# EAGLE design iMote (EAGLE 6.4)
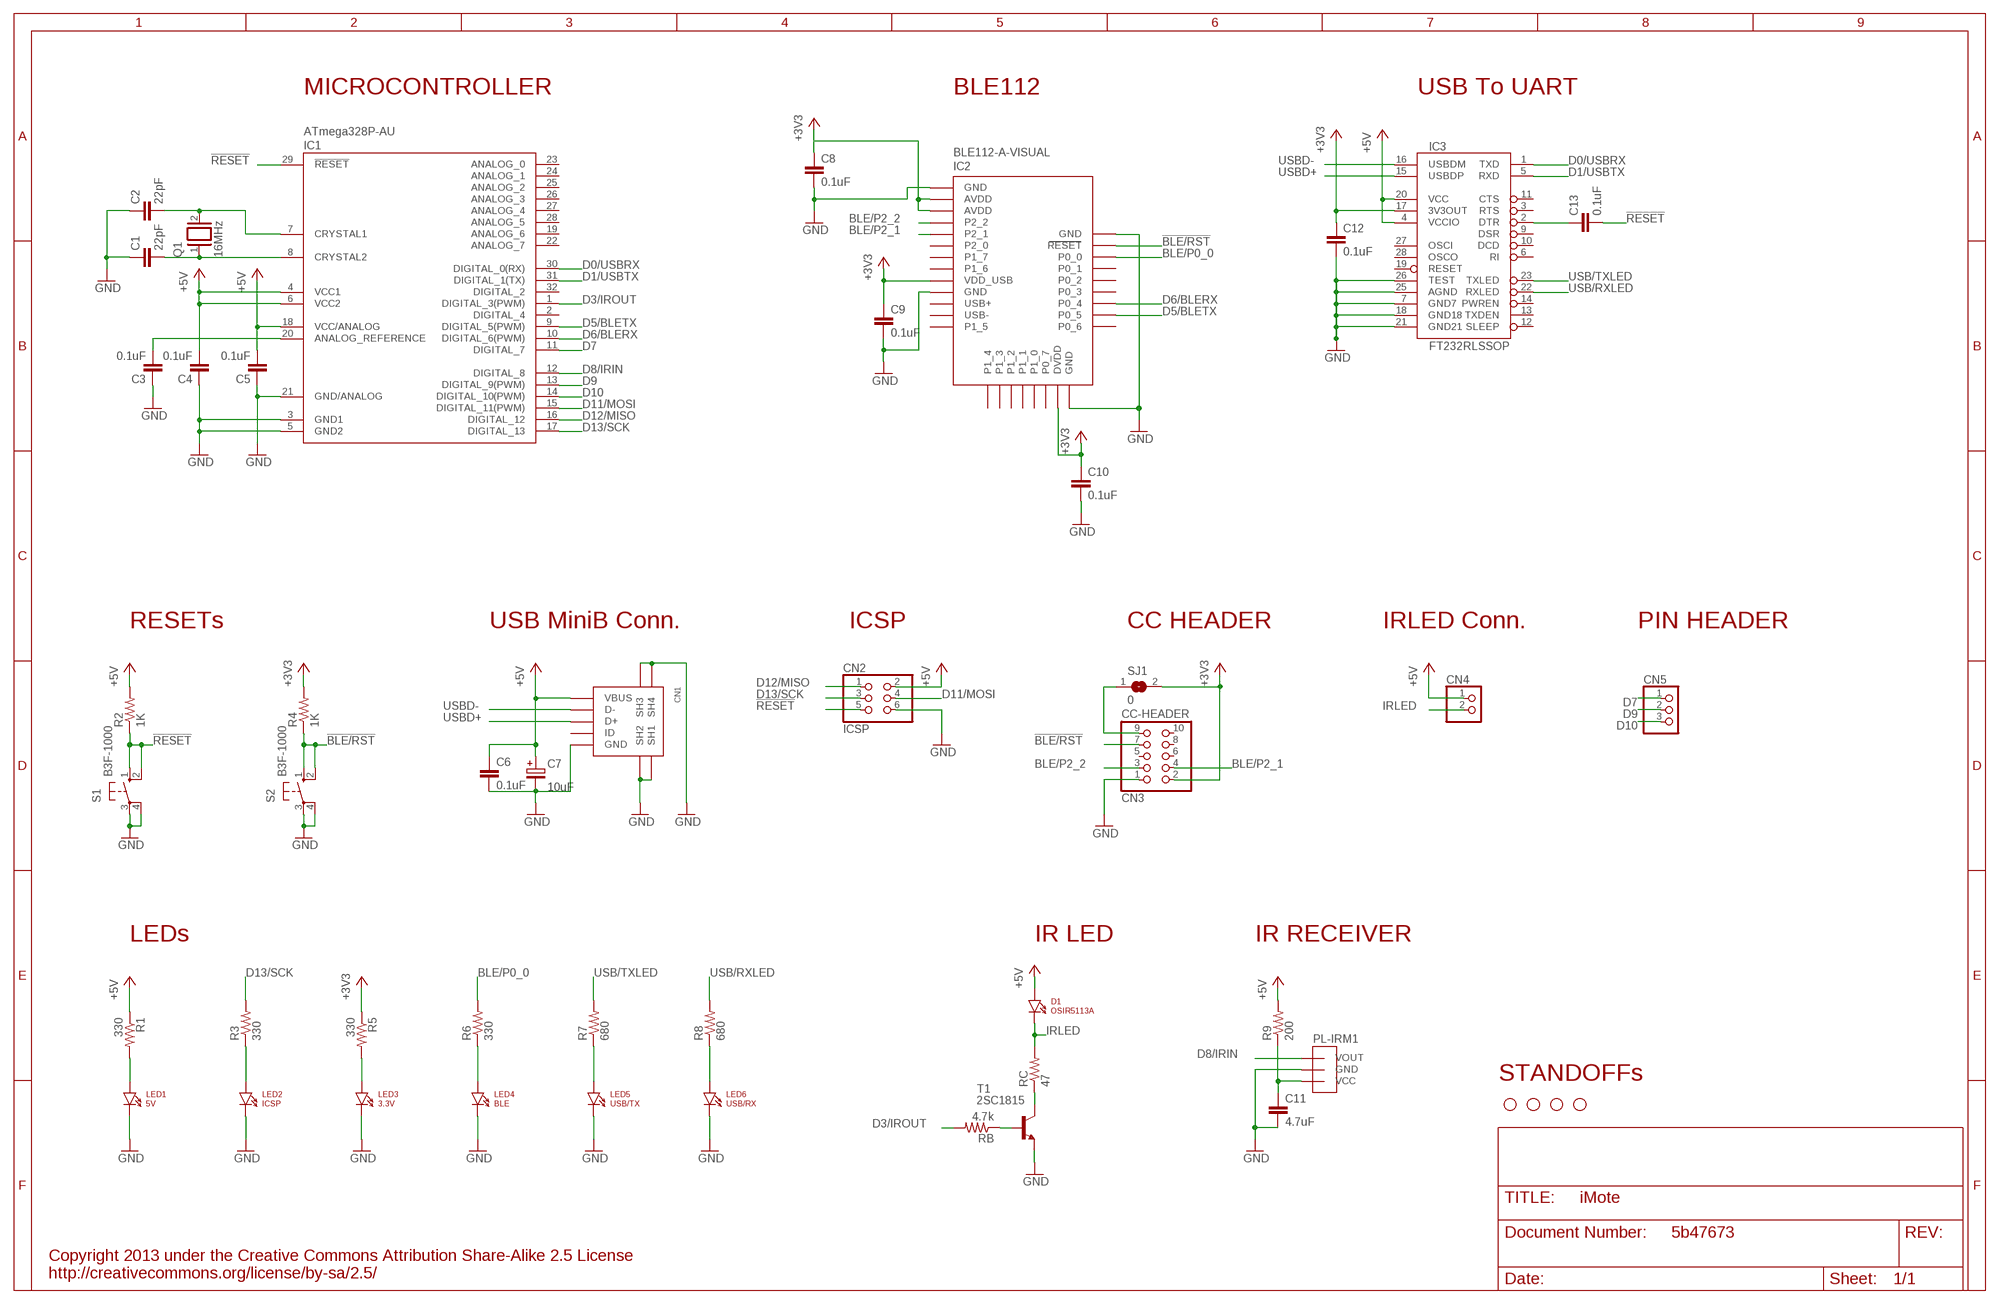
[diagram p0: schematic, sheet 1]

## Parts
C1  22pF  C-2012  [2012]
C2  22pF  C-2012  [2012]
C3  0.1uF  C-2012  [2012]
C4  0.1uF  C-2012  [2012]
C5  0.1uF  C-2012  [2012]
C6  0.1uF  C-2012  [2012]
C7  10uF  CPOL  [E2-5]
C8  0.1uF  C-2012  [2012]
C9  0.1uF  C-2012  [2012]
C10  0.1uF  C-2012  [2012]
C11  4.7uF  C-2012  [2012]
C12  0.1uF  C-2012  [2012]
C13  0.1uF  C-2012  [2012]
CN1  USB-MINIB-UX60SC-MB  [USB-MINIB-UX60SC-MB]
CN2  ICSP  PINHD-2X3  [2X03]
CN3  CC-HEADER  PINHD-2X5  [2X05]
CN4  PINHD-1X2  [1X02]
CN5  PINHEAD-1X03  [PINHEAD-1X03]
D1  OSIR5113A  LED-3MM  [LED-3MM]
IC1  ATmega328P-AU  ATMEGA168-AU  [TQFP32-08]
IC2  BLE112-A-VISUAL  [BLE112-A]
IC3  FT232RLSSOP  [SSOP28DB]
LED1  5V  LED-2012  [LED-2012]
LED2  ICSP  LED-2012  [LED-2012]
LED3  3.3V  LED-2012  [LED-2012]
LED4  BLE  LED-2012  [LED-2012]
LED5  USB/TX  LED-2012  [LED-2012]
LED6  USB/RX  LED-2012  [LED-2012]
PL-IRM1  PL-IRM2161  [IR-RECEIVER]
Q1  16MHz  XTAL-HC-49/S  [XTAL-HC-49/S]
R1  330  R  [2012]
R2  1K  R  [2012]
R3  330  R  [2012]
R4  1K  R  [2012]
R5  330  R  [2012]
R6  330  R  [2012]
R7  680  R  [2012]
R8  680  R  [2012]
R9  200  R  [2012]
RB  4.7k  R  [2012]
RC  47  R  [2012]
S1  B3F-1000  10-XX  [B3F-10XX]
S2  B3F-1000  10-XX  [B3F-10XX]
SJ1  0  SJ  [SJ]
STANDOFF1  STAND-OFF  [STAND-OFF]
STANDOFF2  STAND-OFF  [STAND-OFF]
STANDOFF3  STAND-OFF  [STAND-OFF]
STANDOFF4  STAND-OFF  [STAND-OFF]
T1  2SC1815  [TO92-ECB]
U$1  5b47673  GIT-REVISION  [GIT-REVISION]

## Nets
!BLE/RST: CN3.7 IC2.RESET R4.1 S2.1(S) S2.2(S1)
!RESET: C13.2 CN2.5 IC1.29(!RESET) R2.1 S1.1(S) S1.2(S1)
+3V3 [3.3v]: C8.1 C9.1 C10.1 C12.1 CN3.2 IC2.AVDD IC2.AVDD@2(AVDD) IC2.DVDD IC2.VDD_USB IC3.17(3V3OUT) R4.2 R5.1 SJ1.2
+5V [power]: C4.2 C5.2 C6.1 C7.+ CN1.VBUS CN2.2 CN4.1 D1.A IC1.4(VCC1) IC1.6(VCC2) IC1.18(VCC/ANALOG) IC3.4(VCCIO) IC3.20(VCC) R1.1 R2.2 R9.2
AREF: C3.2 IC1.20(ANALOG_REFERENCE)
BLE/P0_0: IC2.P0_0 R6.2
BLE/P2_1: CN3.4 IC2.P2_1
BLE/P2_2: CN3.3 IC2.P2_2
D0/USBRX: IC1.30(DIGITAL_0(RX)) IC3.1(TXD)
D1/USBTX: IC1.31(DIGITAL_1(TX)) IC3.5(RXD)
D3/IROUT: IC1.1(DIGITAL_3(PWM)) RB.2
D5/BLETX: IC1.9(DIGITAL_5(PWM)) IC2.P0_5
D6/BLERX: IC1.10(DIGITAL_6(PWM)) IC2.P0_4
D7: CN5.1 IC1.11(DIGITAL_7)
D8/IRIN: IC1.12(DIGITAL_8) PL-IRM1.1(VOUT)
D9: CN5.2 IC1.13(DIGITAL_9(PWM))
D10: CN5.3 IC1.14(DIGITAL_10(PWM))
D11/MOSI: CN2.4 IC1.15(DIGITAL_11(PWM))
D12/MISO: CN2.1 IC1.16(DIGITAL_12)
D13/SCK: CN2.3 IC1.17(DIGITAL_13) R3.2
GND [gnd]: C1.1 C2.1 C3.1 C4.1 C5.1 C6.2 C7.- C8.2 C9.2 C10.2 C11.2 C12.2 CN1.GND CN1.S$1(SH1) CN1.S$1@2(SH3) CN1.S$1@3(SH3) CN1.S$2(SH2) CN1.S$2@2(SH4) CN1.S$2@3(SH4) CN2.6 CN3.1 IC1.3(GND1) IC1.5(GND2) IC1.21(GND/ANALOG) IC2.GND IC2.GND@2(GND) IC2.GND@3(GND) IC2.GND@4(GND) IC3.7(GND7) IC3.18(GND18) IC3.21(GND21) IC3.25(AGND) IC3.26(TEST) LED1.C LED2.C LED3.C LED4.C LED5.C LED6.C PL-IRM1.2(GND) S1.3(P) S1.4(P1) S2.3(P) S2.4(P1) T1.E
IRLED [ir-power]: CN4.2 D1.C RC.2
N$1: C1.2 IC1.8(CRYSTAL2) Q1.1
N$2: C2.2 IC1.7(CRYSTAL1) Q1.2
N$3: LED1.A R1.2
N$4: LED5.A R7.1
N$5: LED3.A R5.2
N$6: LED6.A R8.1
N$7: LED2.A R3.1
N$8: C13.1 IC3.2(DTR)
N$10: RB.1 T1.B
N$11 [ir-power]: RC.1 T1.C
N$13: LED4.A R6.1
N$16: C11.1 PL-IRM1.3(VCC) R9.1
PRG/VDD: CN3.9 SJ1.1
USB/RXLED: IC3.22(RXLED) R8.2
USB/TXLED: IC3.23(TXLED) R7.2
USBD+: CN1.D+ IC3.15(USBDP)
USBD-: CN1.D- IC3.16(USBDM)
Unconnected: CN1.ID CN3.5 CN3.6 CN3.8 CN3.10 IC1.2(DIGITAL_4) IC1.19(ANALOG_6) IC1.22(ANALOG_7) IC1.23(ANALOG_0) IC1.24(ANALOG_1) IC1.25(ANALOG_2) IC1.26(ANALOG_3) IC1.27(ANALOG_4) IC1.28(ANALOG_5) IC1.32(DIGITAL_2) IC2.P0_1 IC2.P0_2 IC2.P0_3 IC2.P0_6 IC2.P0_7 IC2.P1_0 IC2.P1_1 IC2.P1_2 IC2.P1_3 IC2.P1_4 IC2.P1_5 IC2.P1_6 IC2.P1_7 IC2.P2_0 IC2.USB+ IC2.USB- IC3.3(RTS) IC3.6(RI) IC3.9(DSR) IC3.10(DCD) IC3.11(CTS) IC3.12(SLEEP) IC3.13(TXDEN) IC3.14(PWREN) IC3.19(RESET) IC3.27(OSCI) IC3.28(OSCO)

## Notes on the sheet
- MICROCONTROLLER | BLE112 | USB To UART
- RESETs | USB MiniB Conn. | ICSP | CC HEADER | IRLED Conn. | PIN HEADER
- LEDs | IR LED | IR RECEIVER
- STANDOFFs
- Copyright 2013 under the Creative Commons Attribution Share-Alike 2.5 License
  http://creativecommons.org/license/by-sa/2.5/

## Library data of the parts
C1-C6 C8-C13 = my:C: CAPACITOR, European symbol
C7 = my:CPOL
CN1 = my:USB-MINIB: USB-MiniB 基板取付用ＵＳＢコネクタ・ミニＢ
CN2 = pinhead:PINHD-2X3: PIN HEADER
CN3 = pinhead:PINHD-2X5: PIN HEADER
CN4 = pinhead:PINHD-1X2: PIN HEADER
CN5 = my:PINHEAD-1X03: PIN HEADER
D1 LED1-LED6 = my:LED: Through-hole LED
IC1 = my:ATMEGA168
IC2 = my:BLE112-A-VISUAL: Bluetooth Low Energy single-mode module - Bluetooth 4.0, chip antenna
IC3 = my:FT232RL: USB UART FT232RL 4th Generation USB UART (USB <-> Serial) Controller. Spark Fun Electronics SKU : COM-00650 Production SKU IC-00870; PROD_ID: IC-00870
PL-IRM1 = my:PL-IRM2161: PL-IRM2161-XD1 IR Receiver http://akizukidenshi.com/catalog/g/gI-06491/ http://akizukidenshi.com/download/ds/paralight/PL-IRM2161-XD1.pdf
Q1 = my:XTAL: CRYSTAL
R1-R9 RB RC = my:R: RESISTOR
S1 S2 = switch-omron:10-XX: OMRON SWITCH; MPN: B3F-1000; OC_FARNELL: 176432; OC_NEWARK: 36M3542
SJ1 = jumper:SJ: SMD solder JUMPER
STANDOFF1-STANDOFF4 = SparkFun-Electromechanical:STAND-OFF: #4 Stand Off This is the mechanical footprint for a #4 phillips button head screw. Use the keepout ring to avoid running the screw head into surrounding components. SKU : PRT-00447
T1 = transistor:2SC1815: NPN EPITAXIAL TRANSISTOR Source: TOSHIBA .. 2SC1815 1.pdf
U$1 = git-revision:GIT-REVISION

## Net classes
0 default: width 0.254 mm
1 power: width 0.406 mm
2 ir-power: width 1.016 mm
3 gnd: width 0.406 mm
4 3.3v: width 0.406 mm

## Board
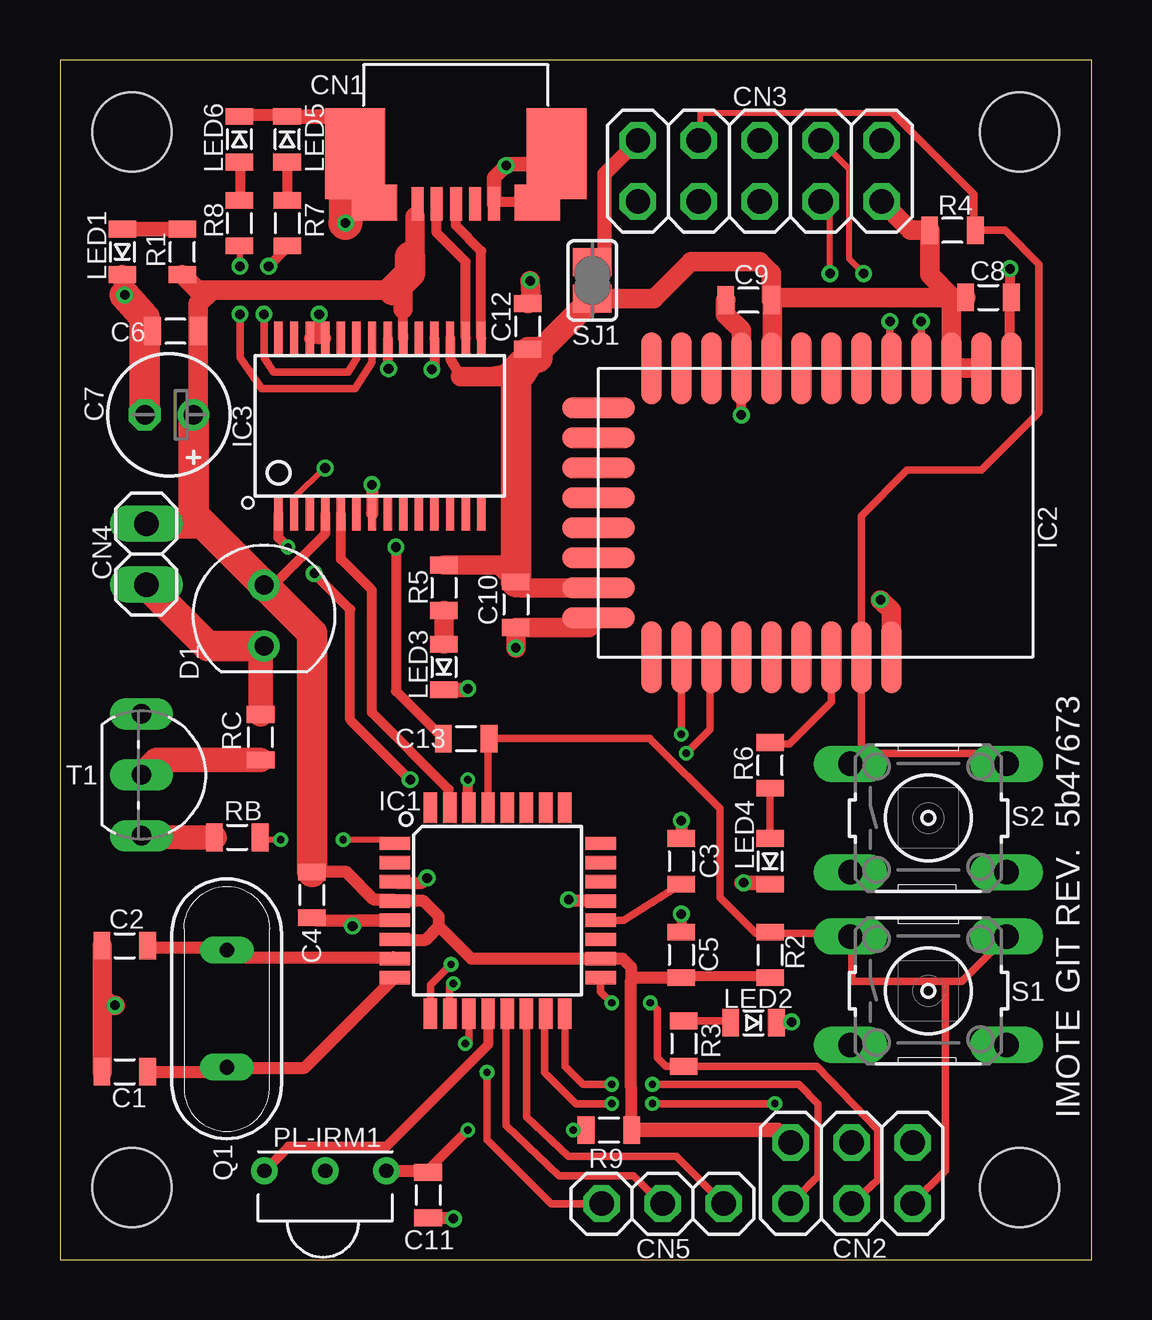
[diagram p1: board, top side]
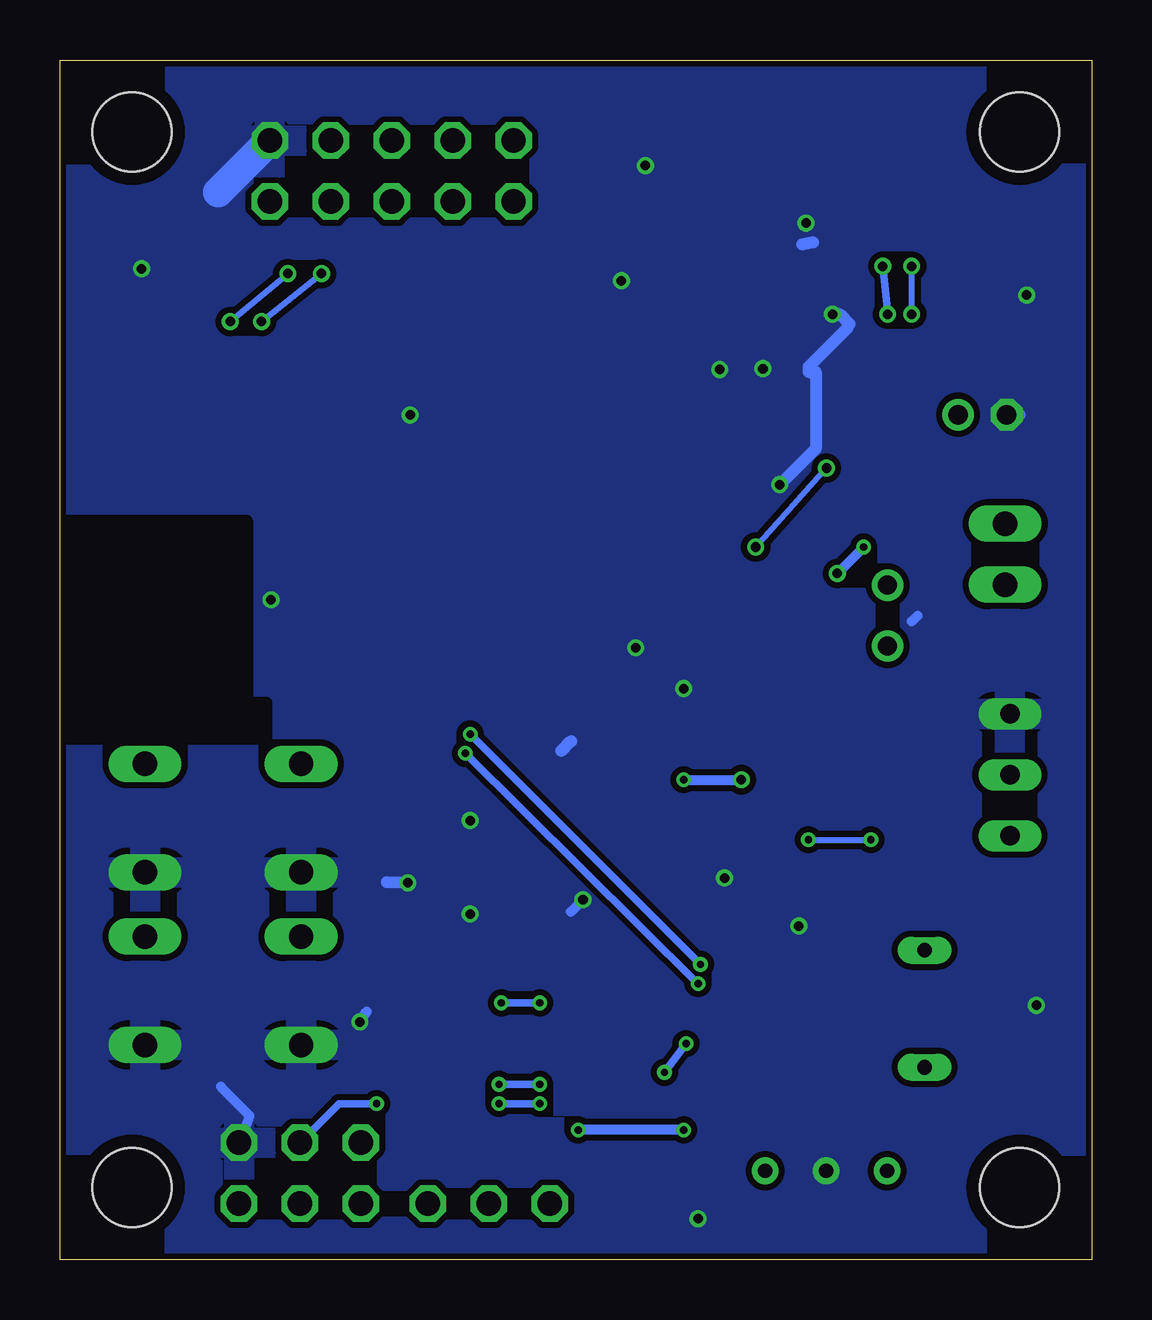
[diagram p2: board, bottom side, seen from below]

Size 43 x 50 mm. Coordinates in mm from the lower left corner, seen from the top.
Outline: 0,0 43,0 43,50 0,50 0,0
Copper layers (1*16): Top 0.035mm / dielectric 1.5mm / Bottom 0.035mm
Design rules "Fusion_eagle_rule_v1.1": minimum track width 6mil, minimum drill 12mil, track to track 6mil, track to pad 6mil, pad to pad 6mil, via to via 6mil, smd to smd 0mil, copper to edge 10mil, drill to drill 10mil, minimum pad ring 10mil, minimum via ring 6mil, stop-mask expansion 2mil, vias tented up to drill 100mil, thermal gap 10mil
bRestrict: area 34.4,21.7 to 42.9,23.2; area 40.7,23.3 to 42.9,30.8

### Footprints (pad centres in the part's own frame; a part is rotated, then mirrored left to right if it is on the bottom)
2012 = smd 0.7 x 1.15: 1 -0.95,0; 2 0.95,0
E2-5 = drill 0.813 pad 1.27: + -1.016,0 | drill 0.813 pad 1.27 octagon: - 1.016,0
USB-MINIB-UX60SC-MB = smd 0.5 x 1.4: D+ 0,5.8; D- 0.8,5.8; GND -1.6,5.8; ID -0.8,5.8; VBUS 1.6,5.8 | smd 1.4 x 4.7: S$1 -3.65,4.15; S$2 3.65,4.15 | smd 1.1 x 3.8: S$1@2 -4.9,3.7; S$2@2 4.9,3.7 | smd 0.5 x 1.5: S$1@3 -2.7,5.75; S$2@3 2.7,5.75
2X03 = drill 1.016 octagon: 1 -2.54,-1.27; 2 -2.54,1.27; 3 0,-1.27; 4 0,1.27; 5 2.54,-1.27; 6 2.54,1.27
2X05 = drill 1.016 octagon: 1 -5.08,-1.27; 2 -5.08,1.27; 3 -2.54,-1.27; 4 -2.54,1.27; 5 0,-1.27; 6 0,1.27; 7 2.54,-1.27; 8 2.54,1.27; 9 5.08,-1.27; 10 5.08,1.27
1X02 = drill 1.016 long: 1 -1.27,0; 2 1.27,0
PINHEAD-1X03 = drill 1.016 octagon: 1 -2.54,0; 2 0,0; 3 2.54,0
LED-3MM = drill 0.8: A -1.27,0; C 1.27,0
TQFP32-08 = smd 1.27 x 0.559: 1 -4.293,2.8; 2 -4.293,2; 3 -4.293,1.2; 4 -4.293,0.4; 5 -4.293,-0.4; 6 -4.293,-1.2; 7 -4.293,-2; 8 -4.293,-2.8; 17 4.293,-2.8; 18 4.293,-2; 19 4.293,-1.2; 20 4.293,-0.4; 21 4.293,0.4; 22 4.293,1.2; 23 4.293,2; 24 4.293,2.8 | smd 0.559 x 1.27: 9 -2.8,-4.293; 10 -2,-4.293; 11 -1.2,-4.293; 12 -0.4,-4.293; 13 0.4,-4.293; 14 1.2,-4.293; 15 2,-4.293; 16 2.8,-4.293; 25 2.8,4.293; 26 2,4.293; 27 1.2,4.293; 28 0.4,4.293; 29 -0.4,4.293; 30 -1.2,4.293; 31 -2,4.293; 32 -2.8,4.293
BLE112-A = smd 3 x 0.85: AVDD -6.05,6.9; AVDD@2 -6.05,5.65; GND -6.05,8.15; GND@2 -6.05,-3.1; GND@4 6,3.15; P0_0 6,0.65; P0_1 6,-0.6; P0_2 6,-1.85; P0_3 6,-3.1; P0_4 6,-4.35; P0_5 6,-5.6; P0_6 6,-6.85; P1_5 -6.05,-6.85; P1_6 -6.05,-0.6; P1_7 -6.05,0.65; P2_0 -6.05,1.9; P2_1 -6.05,3.15; P2_2 -6.05,4.4; RESET 6,1.9; USB+ -6.05,-4.35; USB- -6.05,-5.6; VDD_USB -6.05,-1.85 | smd 0.85 x 3: DVDD 3.1,-9.05; GND@3 4.35,-9.05; P0_7 1.85,-9.05; P1_0 0.6,-9.05; P1_1 -0.65,-9.05; P1_2 -1.9,-9.05; P1_3 -3.15,-9.05; P1_4 -4.4,-9.05
SSOP28DB = smd 0.348 x 1.397: 1 -4.225,-3.656; 2 -3.575,-3.656; 3 -2.925,-3.656; 4 -2.275,-3.656; 5 -1.625,-3.656; 6 -0.975,-3.656; 7 -0.325,-3.656; 8 0.325,-3.656; 9 0.975,-3.656; 10 1.625,-3.656; 11 2.275,-3.656; 12 2.925,-3.656; 13 3.575,-3.656; 14 4.225,-3.656; 15 4.225,3.656; 16 3.575,3.656; 17 2.925,3.656; 18 2.275,3.656; 19 1.625,3.656; 20 0.975,3.656; 21 0.325,3.656; 22 -0.325,3.656; 23 -0.975,3.656; 24 -1.625,3.656; 25 -2.275,3.656; 26 -2.925,3.656; 27 -3.575,3.656; 28 -4.225,3.656
LED-2012 = smd 0.7 x 1.15: A -0.95,0; C 0.95,0
IR-RECEIVER = drill 0.6: 1 -2.54,0; 2 0,0; 3 2.54,0
XTAL-HC-49/S = drill 0.61 long: 1 -2.44,0; 2 2.44,0
B3F-10XX = drill 1.016 long: 1 -3.251,2.261; 2 3.251,2.261; 3 -3.251,-2.261; 4 3.251,-2.261
SJ = smd 1.168 x 1.6: 1 -0.762,0; 2 0.762,0
STAND-OFF = hole 3.302: 0,0
TO92-ECB = drill 0.813 long: B 2.54,0; C 0,0; E -2.54,0

### Placement (x,y rotation side)
C1  2.7,7.83 0 top
C2  2.7,13.08 0 top
C3  25.9,16.6 270 top
C4  10.5,15.2 90 top
C5  25.9,12.7 270 top
C6  4.81,38.7 180 top
C7  4.55,35.21 180 top
C8  38.7,40.1 0 top
C9  28.7,39.99 180 top
C10  19,27.3 270 top
C11  15.34,2.69 270 top
C12  19.5,38.9 90 top
C13  16.93,21.71 0 top
CN1  16.5,49.8 180 top
CN2  33,3.6 0 top
CN3  29.17,45.37 180 top
CN4  3.6,29.4 270 top
CN5  25.12,2.33 0 top
D1  8.51,26.84 270 top
IC1  18.24,14.54 0 top
IC2  31.5,31.1 270 top
IC3  13.34,34.74 0 top
LED1  2.6,42 270 top
LED2  28.91,9.87 0 top
LED3  16,24.7 270 top
LED4  29.6,16.6 270 top
LED5  9.47,46.69 90 top
LED6  7.48,46.69 90 top
PL-IRM1  11.06,3.7 0 top
Q1  6.95,10.45 90 top
R1  5.1,42 90 top
R2  29.6,12.7 270 top
R3  26,9 270 top
R4  37.2,42.9 180 top
R5  16,28 270 top
R6  29.6,20.6 90 top
R7  9.47,43.2 270 top
R8  7.47,43.2 270 top
R9  22.88,5.4 0 top
RB  7.39,17.59 0 top
RC  8.36,21.77 90 top
S1  36.2,11.2 0 top
S2  36.2,18.4 0 top
SJ1  22.19,40.81 270 top
STANDOFF1  40,3 0 top
STANDOFF2  3,3 0 top
STANDOFF3  40,47 0 top
STANDOFF4  3,47 0 top
T1  3.4,20.2 270 top
U$1  42.5,11.1 90 top

### Tracks (layer width: path | path; a pad name or v marks a point on that pad's centre or on a via)
!BLE/RST
  Top 0.254: 34.7,47.8 26.7,47.8 26.7,46.7 CN3.7 | 38.1,42.9 R4.1 | 33.4,25.2 IC2.RESET | 33.4,21.1 33.4,21.4 33.4,21.5 | 33,20.7 S2.1
  Top 0.305: 33.4,21.5 IC2.RESET | 33.4,25.2 33.4,31 35.3,32.9 38.4,32.9 40.8,35.3 40.8,41.5 39.4,42.9 38.1,42.9 38.1,44.4 34.7,47.8 | 33.4,21.1 33,20.7 | S2.1 33.5,21.1 39.4,21.1 39.4,20.7 S2.2
!RESET
  Top 0.254: 35.6,2.4 CN2.5 | 39.4,13.4 S1.2 | 37.5,11.6 37.6,11.6 | 33,13.4 S1.1 | 17.9,21.5 C13.2 | 32.9,13.5 32.9,13.6 | R2.1 29.6,13.7 29.6,13.6
  Top 0.305: 39.4,13.4 37.6,11.6 | 36.9,11.6 33,11.6 33,13.4 | 36.9,11.6 37.5,11.6 | 32.9,13.6 29.6,13.6 29,13.6 27.5,15.1 27.5,18.8 24.7,21.6 24.59,21.71 23,21.71 | 32.9,13.5 S1.1 | IC1.29 17.84,21.67 C13.2 23,21.71 | 23.49,21.71 23,21.71 | 35.6,2.4 36.9,3.7 36.9,11.6
+3V3
  Top 0.406: 21.9,39.7 SJ1.2 | C8.1 37.7,40.1 37.2,40.1 37.1,40.1 37.1,39.9 | 38.4,37.2 IC2.AVDD | 29.7,39.9 C9.1 | 29.7,37.2 IC2.VDD_USB | 29.8,40.1 C9.1 | 29.8,40.3 C9.1 | IC3.17 16.26,37.54 16.7,36.8 18.45,37.1 C12.1
  Top 0.813: SJ1.2 24.75,40.05 26.3,41.6 28.6,41.6 29.17,41.6 29.66,41.11 C9.1 29.7,39.94 29.7,37.2 | 29.8,40.1 37.2,40.1 | 37.2,40.1 C8.1 | 37.2,40.1 36.25,41.05 R4.2 35.45,42.9 CN3.2 | IC2.AVDD IC2.AVDD@2 37.15,39.85 37.1,39.9 | 19.9,37.6 19.4,36.8 16.7,36.8 | IC2.DVDD 19.25,28 C10.1 18.3,28.95 R5.1
  Top 1.016: C12.1 20.09,37.95 SJ1.2
  Top 1.27: C10.1 19,36.7 arc-90 19.9,37.6
+5V
  Top 0.406: IC3.20 14.3,38.6 | 14.3,38.6 14.3,39.61 | 14.8,43.46 CN1.VBUS | 14.3,38.6 IC3.20 | 14.31,39.62 14.2,39.9 13.89,40.41 | C6.1 5.8,38.7 C6.1 | D1.A 9.1,28.3 11,30.2 11.06,30.26 IC3.4 | 10.5,16.2 C4.2 | C5.2 26.1,11.8 29.6,11.8 R2.2 | 23.8,5.94 R9.2
  Top 0.457: 5.77,35.1 C7.+
  Top 0.5: C4.2 11.95,16.15 13.1,15 13.89,15 IC1.4 15.16,14.94 15.8,14.3 15.8,13.88 | IC1.6 13.96,13.33 15.25,13.33 15.8,13.88 | 15.8,13.88 17.14,12.54 IC1.18 23.46,12.54 23.8,12.2 23.8,11.6 | 23.8,11.6 23.8,7.2 23.8,5.94 | C5.2 23.95,11.75 23.8,11.6
  Top 0.508: 14.8,41.96 14.6,41.8
  Top 0.61: 14.1,40.41 13.89,40.41 | 14.31,39.62 14.3,39.61 | R9.2 29.93,5.4 CN2.2
  Top 0.813: 5.77,35.1 C6.1 5.77,38.79 | 14.31,40.41 14.31,39.62 | 14.8,43.46 14.8,41.96 | 6.6,40.41 6.34,40.41 5.76,39.83 C6.1 | 6.6,40.41 13.89,40.41 | R1.1 5.74,40.41 6.6,40.41
  Top 1.27: 14.6,41.8 14.6,41.12 13.89,40.41 | CN4.1 5.95,30.67 6.11,30.51 | 6.11,30.51 D1.A 10.5,26.12 C4.2 | C7.+ 5.56,31.06 6.11,30.51
AREF
  Top 0.305: IC1.20 23.49,14.14 C3.2
BLE/P0_0
  Top 0.305: IC2.P0_0 32.15,23.25 30.4,21.5 29.65,21.5
  Top 0.406: 29.6,21.6 R6.2
  Top 0.61: 29.65,21.5 R6.2
BLE/P2_1  (via drill 0.4)
  Top 0.254: v32.1,41.1 32.1,44.1 31.8,44.1 CN3.4 | 34.6,37.2 IC2.P2_1
  Top 0.305: 34.6,37.2 34.6,38.7 v34.6,39.1
  Bottom 0.254: v34.6,39.1 v32.1,41.1
BLE/P2_2  (via drill 0.4)
  Top 0.254: CN3.3 32.9,45.45 32.9,41.7 v33.5,41.1 | 35.9,37.2 IC2.P2_2
  Top 0.305: 35.9,37.2 35.9,38.6 v35.9,39.1
  Bottom 0.254: v35.9,39.1 v33.5,41.1
D0/USBRX  (via drill 0.3, 0.4)
  Top 0.254: 17,18.9 IC1.30
  Top 0.406: 17,18.9 v17,20 | v14.6,20 12.1,22.5 12.1,27.1 v10.6,28.6 | v9.5,29.7 9.11,30.09 IC3.1
  Bottom 0.406: v17,20 v14.6,20 | v10.6,28.6 v9.5,29.7
D1/USBTX
  Top 0.254: 11.8,31 IC3.5
  Top 0.406: IC1.31 16.2,18.88 16.2,19.6 13,22.8 13,27.9 11.71,29.19 IC3.5
D3/IROUT  (via drill 0.3)
  Top 0.254: v9.2,17.5 8.4,17.5 RB.2 | v11.8,17.5 13.9,17.5 13.9,17.4 IC1.1
  Bottom 0.254: v11.8,17.5 v9.2,17.5
D5/BLETX  (via drill 0.3)
  Top 0.305: IC2.P0_5 v25.9,21.9 | IC1.9 15.44,11.44 v16.3,12.3
  Bottom 0.305: v25.9,21.9 v16.3,12.3
D6/BLERX  (via drill 0.3)
  Top 0.254: 27.1,25.1 IC2.P0_4
  Top 0.305: IC1.10 16.24,11.34 v16.4,11.5 | 27.1,25.1 27.1,22.1 v26.1,21.1
  Bottom 0.305: v26.1,21.1 v16.4,11.5
D7  (via drill 0.3)
  Top 0.305: CN5.1 20.47,2.33 17.8,5 v17.8,7.8 | v16.9,9 17.04,9.14 IC1.11
  Bottom 0.305: v17.8,7.8 v16.9,9
D8/IRIN
  Top 0.406: IC1.12 17.84,8.94 13.6,4.7 9.53,4.7 PL-IRM1.1
D9
  Top 0.305: 25.07,2.33 23.9,3.5 20.8,3.5 18.6,5.6 18.6,10.21
  Top 0.406: CN5.2 25.07,2.33 | 18.6,10.21 IC1.13
D10
  Top 0.305: IC1.14 19.44,5.96 21.2,4.3 25.69,4.3 CN5.3
D11/MOSI  (via drill 0.3)
  Top 0.305: v23,6.5 21.5,6.5 20.2,7.8 20.2,10.21 IC1.15 | v24.7,6.5 v29.8,6.5
  Bottom 0.305: v24.7,6.5 v23,6.5 | v29.8,6.5 31.37,6.5 CN2.4
D12/MISO  (via drill 0.3)
  Top 0.305: IC1.16 21.04,8.06 21.8,7.3 v23,7.3 | CN2.1 31.6,3.47 31.6,6.5 30.8,7.3 v24.7,7.3
  Bottom 0.305: v23,7.3 v24.7,7.3
D13/SCK  (via drill 0.3)
  Top 0.305: CN2.3 34.1,3.33 34.1,5.4 31.55,8.05 R3.2 25.25,8.05 24.9,8.4 24.9,10.4 v24.6,10.7 | IC1.17 22.54,11.16 v23,10.7
  Bottom 0.305: v24.6,10.7 v23,10.7
GND  (via drill 0.4)
  Top 0.406: IC3.21 13.66,37.26 13.6,37.2 v13.7,37.13 | IC3.18 15.61,37.21 v15.5,37.1 | 26.1,17.6 C3.1 | v25.9,14.4 C5.1 | v39.6,41.3 39.6,40.1 C8.2 39.6,39.9 39.6,37.2 IC2.GND | v28.4,35.2 28.4,36.9 IC2.GND@2 | 27.9,39.8 27.8,39.9 C9.2 | C6.2 3.9,38.7 3.53,38.7 | CN1.S$2@3 13.8,44.1 12.6,44.1 CN1.S$2 | CN1.S$1@3 19.2,44.1 18.4,44.1 18.1,44.1 | 14,15.7 IC1.3 | v28.5,15.7 v28.5,15.69
  Top 0.5: C4.1 10.61,14.14 IC1.5 12.44,14.14 v12.2,13.9 | v25.9,18.3 C3.1 | IC1.21 21.26,14.94 v21.2,15 | 14,15.7 15.1,15.7 v15.3,15.9 | C11.2 16.36,1.74 v16.4,1.7
  Top 0.508: IC3.25 10.8,38.4 | 10.8,38.4 IC3.26 | v10.8,39.4 10.8,38.4 | v13,32.3 IC3.7 | LED6.C 7.5,47.7 9.2,47.7 LED5.C | CN1.S$1@2 20.2,46.2 20.2,46 CN1.S$1 | CN1.S$2 12.8,45.7 11.9,45.7
  Top 0.61: CN1.GND 18.1,44.1 18.1,45.1 v18.6,45.6 18.65,45.65 CN1.S$1 | LED5.C 11.76,47.64 11.9,47 11.9,46.4 CN1.S$2@2 | 28.41,15.69 v28.5,15.69 29.56,15.69 LED4.C | LED3.C 16.95,23.75 v17,23.8 | LED2.C v30.5,9.9
  Top 0.813: C12.2 19.64,40.26 v19.6,40.8 | C1.1 C2.1 1.75,11.15 arc90 v2.3,10.6 | v19,25.5 C10.2 22.05,26.35 IC2.GND@3 | IC2.GND@4 34.65,27.05 v34.2,27.5 | IC2.GND@2 28.4,38.73 27.74,39.39 27.74,39.98 C9.2 | LED1.C v2.7,40.2
  Top 1.016: 11.9,46.4 11.9,46.3
  Top 1.27: C7.- 3.53,38.7 3.53,39.27 v2.7,40.2
  Top 1.422: 11.9,46.3 11.9,45.7 v11.9,43.2
  Bottom 0.406: 36.3,7.2 35.1,6 CN2.6 | 21.7,14.5 v21.2,15 | v30.5,9.9 30.22,10.34 | 7.5,26.6 7.25,26.84 7.5,26.6
  Bottom 0.508: C7.- 3.3,35.2 3,35.2 | v10.8,39.4 10.6,39.4 10.5,39.4 10.09,38.99 10.2,38.8 11.8,37.2 11.8,37 11.5,37 11.5,33.8 v13,32.3 | 11.6,42.4 12.06,42.31 | 22.1,21.2 21.69,21.61 | v28.5,15.7 29.37,15.72
  Bottom 1.016: CN3.1
  Bottom 1.27: CN3.1 36.4,44.5
  pour Bottom (isolate 0.254): 0,50 43,50 43,0 0,0
IRLED
  Top 1.016: RC.2 8.36,25.12 D1.C
  Top 1.27: D1.C 6.16,25.57 CN4.2
N$1
  Top 0.254: 3.7,7.8 C1.2 3.8,7.8 | 6.9,7.8 6.9,7.9 Q1.1 7,8 | 13.9,11.7 IC1.8
  Top 0.5: 6.9,7.8 3.8,7.8 | 13.9,11.7 10.2,8 7,8
N$2
  Top 0.254: 3.7,13 C2.2 3.8,13 | 6.9,13 Q1.2 7,12.9 | 13.9,12.6 IC1.7
  Top 0.5: 6.9,13 3.8,13 | 13.9,12.6 7,12.6 7,12.9
N$3
  Top 0.61: LED1.A R1.2
N$4
  Top 0.406: LED5.A 9.47,44.25 R7.1
N$5
  Top 0.813: LED3.A R5.2
N$6
  Top 0.254: 7.5,44.3 R8.1 | 7.5,45.5 LED6.A
  Top 0.406: 7.5,45.5 7.5,44.28 R8.1
N$7
  Top 0.305: R3.1 27.88,9.95 LED2.A
N$8  (via drill 0.4)
  Top 0.254: v11.05,32.99 9.76,31.77 9.76,31.07 IC3.2
  Top 0.406: v14,29.7 14,23.69 C13.1
  Bottom 0.254: v11.05,32.99 v14,29.7
N$10
  Top 0.254: 6.4,17.6 RB.1
  Top 1.016: T1.B 5.08,17.59 RB.1
N$11
  Top 1.016: RC.1 4.02,20.82 T1.C
N$13
  Top 0.254: 29.6,19.8 R6.1
  Top 0.305: R6.1 LED4.A
N$16  (via drill 0.3)
  Top 0.406: v21.4,5.4 R9.1 | C11.1 15.34,3.74 v17,5.4
  Top 0.5: PL-IRM1.3 15.28,3.7 C11.1
  Bottom 0.406: v17,5.4 v21.4,5.4
PRG/VDD
  Top 0.254: SJ1.1 22.2,41.6 22.4,41.8 22.4,41.9 22.7,42
  Top 0.61: CN3.9 22.7,45.25 22.7,42
USB/RXLED  (via drill 0.4)
  Top 0.254: v7.5,41.4 7.5,42.3 R8.2 | IC3.22
  Top 0.305: IC3.22 13,37.4 12.3,36.3 8.4,36.3 7.5,37.6 v7.5,39.4
  Bottom 0.254: v7.5,39.4 v7.5,41.4
USB/TXLED  (via drill 0.4)
  Top 0.305: IC3.23 12.36,37.56 12,37 8.9,37 8.5,37.6 v8.5,39.4
  Top 0.406: R7.2 9.47,42.17 v8.7,41.4
  Bottom 0.305: v8.5,39.4 v8.7,41.4
USBD+
  Top 0.406: IC3.15 17.56,42.04 16.5,43.1 CN1.D+
USBD-
  Top 0.406: IC3.16 16.91,41.59 15.7,42.8 CN1.D-

### Text on the board
tNames: IMOTE